# EAGLE schematic base_board (EAGLE 8.0.1)
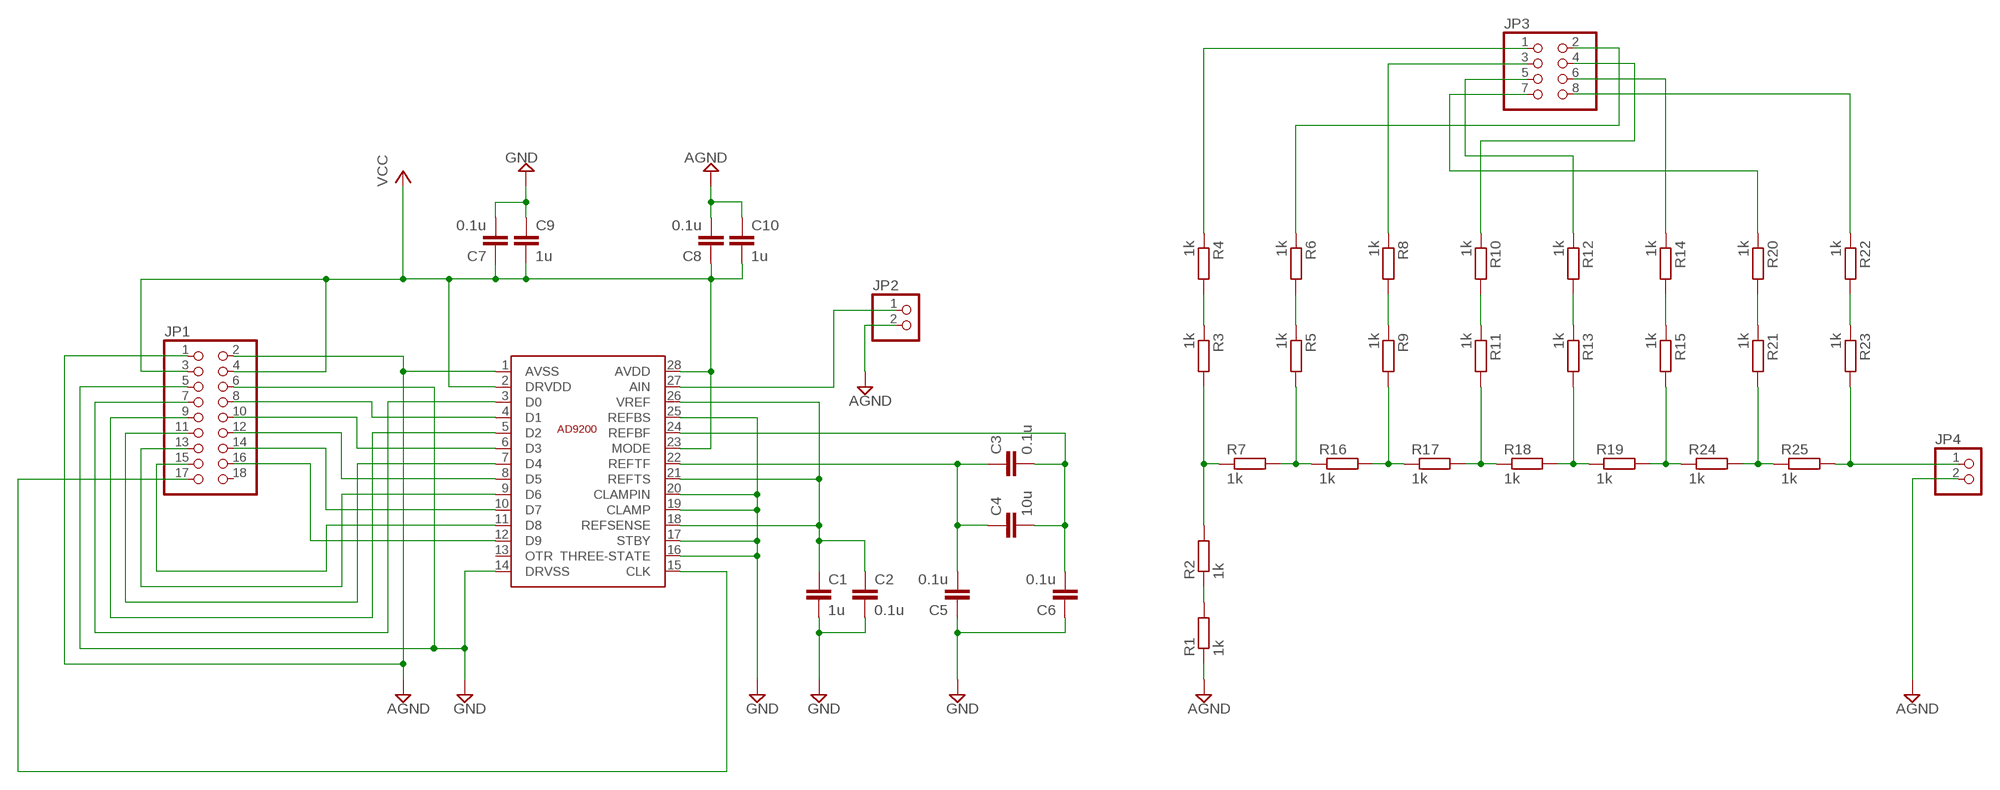
[diagram p0: schematic, sheet 1]

## Parts
C1  1u  C-EUC0805  [C0805]
C2  0.1u  C-EUC0805  [C0805]
C3  0.1u  C-EUC0805  [C0805]
C4  10u  C-EUC0805  [C0805]
C5  0.1u  C-EUC0805  [C0805]
C6  0.1u  C-EUC0805  [C0805]
C7  0.1u  C-EUC0805  [C0805]
C8  0.1u  C-EUC0805  [C0805]
C9  1u  C-EUC0805  [C0805]
C10  1u  C-EUC0805  [C0805]
JP1  PINHD-2X9  [2X09]
JP2  PINHD-1X2  [1X02]
JP3  PINHD-2X4  [2X04]
JP4  PINHD-1X2  [1X02]
R1  1k  R-EU_R0805  [R0805]
R2  1k  R-EU_R0805  [R0805]
R3  1k  R-EU_R0805  [R0805]
R4  1k  R-EU_R0805  [R0805]
R5  1k  R-EU_R0805  [R0805]
R6  1k  R-EU_R0805  [R0805]
R7  1k  R-EU_R0805  [R0805]
R8  1k  R-EU_R0805  [R0805]
R9  1k  R-EU_R0805  [R0805]
R10  1k  R-EU_R0805  [R0805]
R11  1k  R-EU_R0805  [R0805]
R12  1k  R-EU_R0805  [R0805]
R13  1k  R-EU_R0805  [R0805]
R14  1k  R-EU_R0805  [R0805]
R15  1k  R-EU_R0805  [R0805]
R16  1k  R-EU_R0805  [R0805]
R17  1k  R-EU_R0805  [R0805]
R18  1k  R-EU_R0805  [R0805]
R19  1k  R-EU_R0805  [R0805]
R20  1k  R-EU_R0805  [R0805]
R21  1k  R-EU_R0805  [R0805]
R22  1k  R-EU_R0805  [R0805]
R23  1k  R-EU_R0805  [R0805]
R24  1k  R-EU_R0805  [R0805]
R25  1k  R-EU_R0805  [R0805]
U$2  AD9200ARZ  [SSOP28]

## Nets
AGND: C8.2 C10.1 JP1.1 JP1.2 JP2.2 JP4.2 R1.1 U$2.1(AVSS)
GND: C1.2 C2.2 C5.1 C6.1 C7.2 C9.1 JP1.5 JP1.6 U$2.14(DRVSS) U$2.16(THREE-STATE) U$2.17(STBY) U$2.19(CLAMP) U$2.20(CLAMPIN) U$2.25(REFBS)
N$1: JP1.7 U$2.3(D0)
N$2: C1.1 C2.1 U$2.18(REFSENSE) U$2.21(REFTS) U$2.26(VREF)
N$3: JP1.8 U$2.4(D1)
N$4: C3.1 C4.1 C5.2 U$2.22(REFTF)
N$5: C3.2 C4.2 C6.2 U$2.24(REFBF)
N$6: JP1.9 U$2.5(D2)
N$7: JP1.10 U$2.6(D3)
N$8: JP1.11 U$2.7(D4)
N$9: JP1.12 U$2.8(D5)
N$10: JP1.13 U$2.9(D6)
N$11: JP1.14 U$2.10(D7)
N$12: JP1.15 U$2.11(D8)
N$13: JP1.16 U$2.12(D9)
N$14: JP1.17 U$2.15(CLK)
N$15: JP2.1 U$2.27(AIN)
N$16: R1.2 R2.1
N$17: R2.2 R3.2 R7.1
N$18: R3.1 R4.2
N$19: R5.2 R7.2 R16.1
N$20: R9.2 R16.2 R17.1
N$21: R11.2 R17.2 R18.1
N$22: R13.2 R18.2 R19.1
N$23: R15.2 R19.2 R24.1
N$24: R21.2 R24.2 R25.1
N$25: R5.1 R6.2
N$26: R8.2 R9.1
N$27: R10.2 R11.1
N$28: R12.2 R13.1
N$29: R14.2 R15.1
N$30: R20.2 R21.1
N$31: R22.2 R23.1
N$32: JP4.1 R23.2 R25.2
N$33: JP3.1 R4.1
N$34: JP3.2 R6.1
N$35: JP3.3 R8.1
N$36: JP3.4 R10.1
N$37: JP3.5 R12.1
N$38: JP3.6 R14.1
N$39: JP3.7 R20.1
N$40: JP3.8 R22.1
VCC: C7.1 C8.1 C9.2 C10.2 JP1.3 JP1.4 U$2.2(DRVDD) U$2.23(MODE) U$2.28(AVDD)
Unconnected: JP1.18 U$2.13(OTR)

## Library data of the parts
C1-C10 = rcl:C-EU: CAPACITOR, European symbol
JP1 = pinhead:PINHD-2X9: PIN HEADER
JP2 JP4 = pinhead:PINHD-1X2: PIN HEADER
JP3 = pinhead:PINHD-2X4: PIN HEADER
R1-R25 = rcl:R-EU_: RESISTOR, European symbol
U$2 = ad9200:AD9200: 10-Bit, 20 MSPS, 80 mW CMOS A/D Converter